# EAGLE design DC-DC (EAGLE 9.6.2)
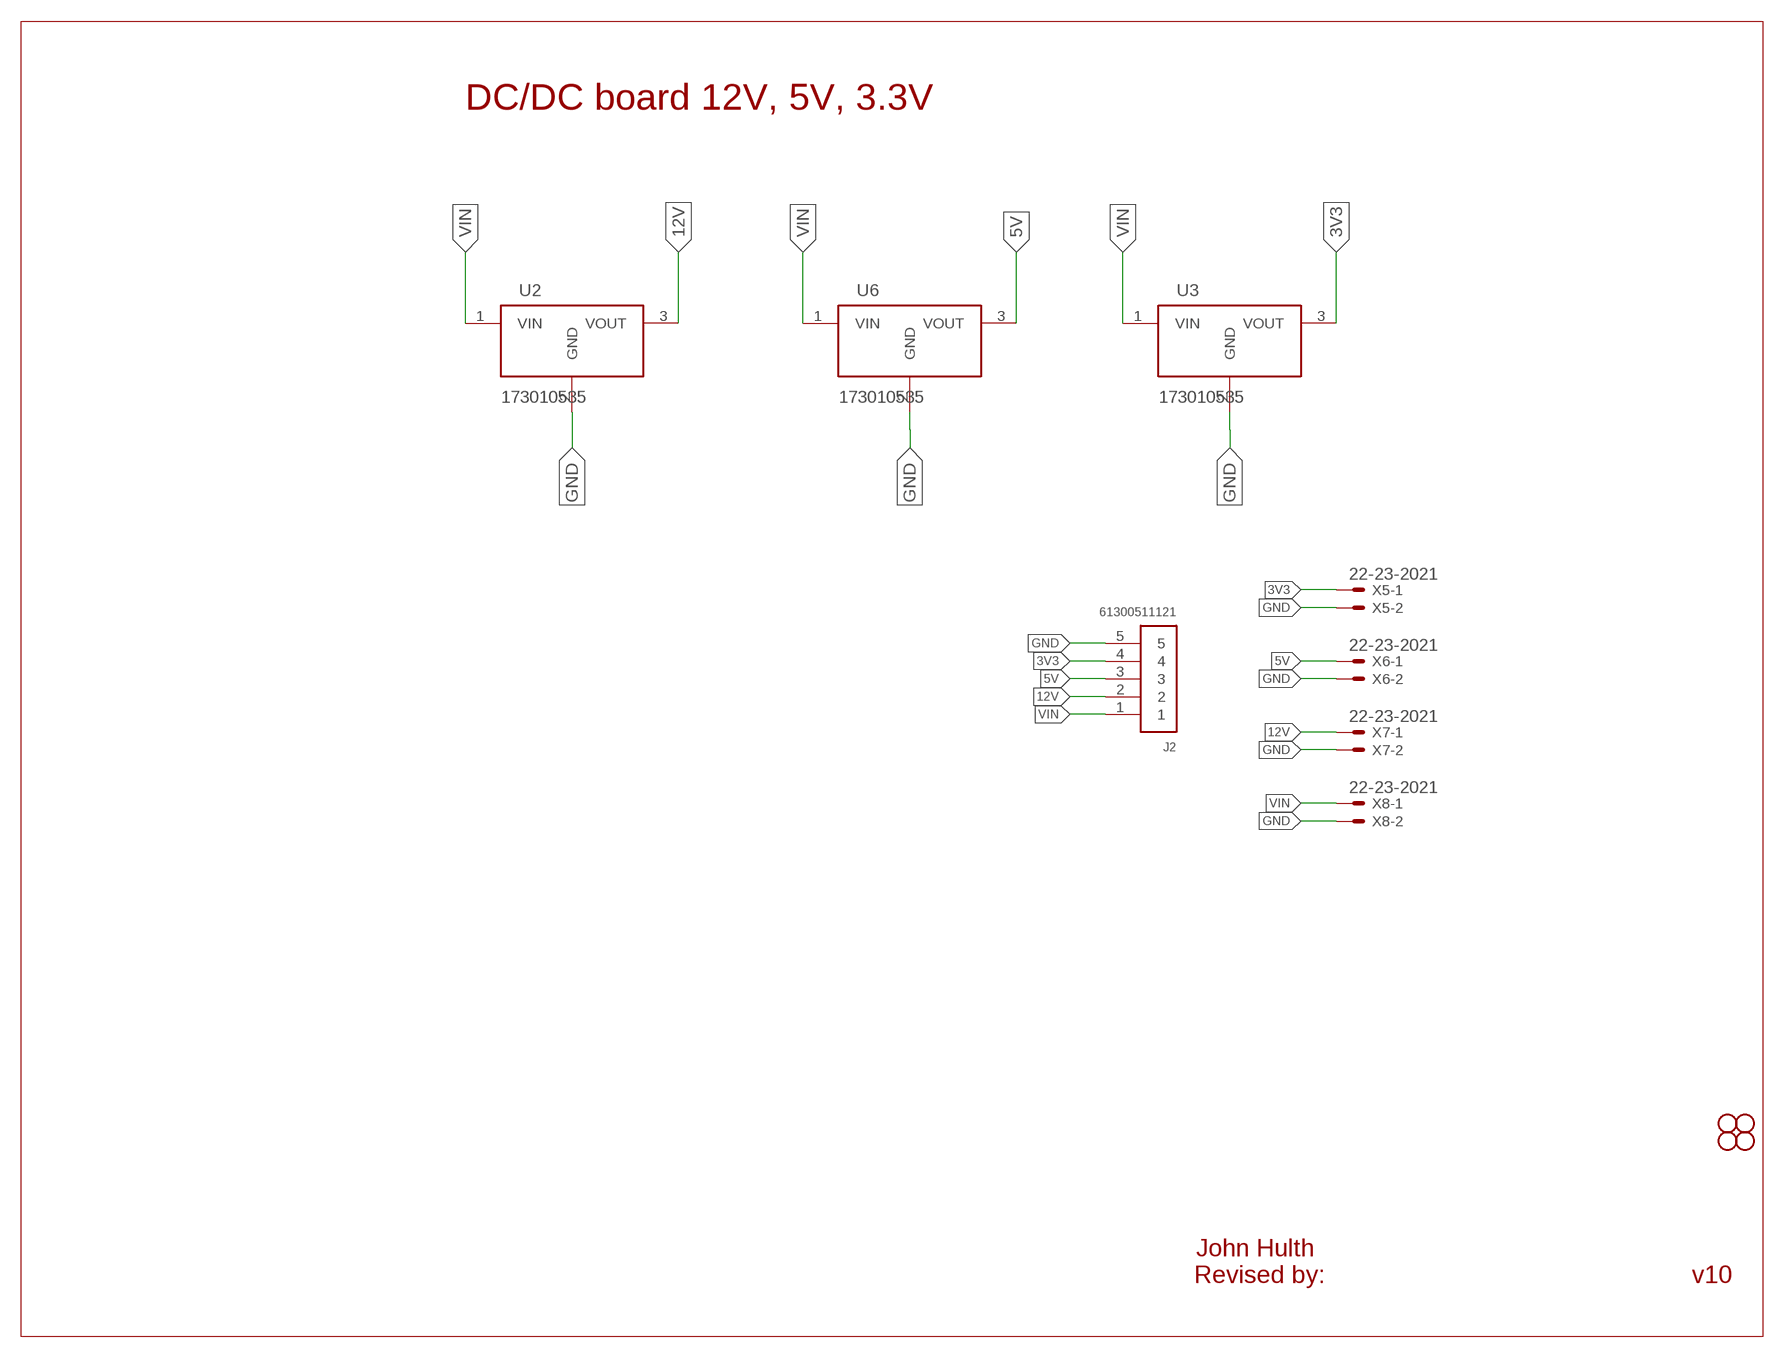
[diagram p0: schematic, sheet 1]

## Parts
J2  61300511121  [61300511121]
JP1  STAND-OFF  [STAND-OFF]
JP4  STAND-OFF  [STAND-OFF]
JP5  STAND-OFF  [STAND-OFF]
JP6  STAND-OFF  [STAND-OFF]
U2  173010535  [173010535]
U3  173010535  [173010535]
U6  173010535  [173010535]
X5  22-23-2021  [22-23-2021]
X6  22-23-2021  [22-23-2021]
X7  22-23-2021  [22-23-2021]
X8  22-23-2021  [22-23-2021]

## Nets
3V3: J2.4 U3.3(VOUT) X5.1
5V: J2.3 U6.3(VOUT) X6.1
12V: J2.2 U2.3(VOUT) X7.1
GND: J2.5 U2.2(GND) U3.2(GND) U6.2(GND) X5.2 X6.2 X7.2 X8.2
VIN: J2.1 U2.1(VIN) U3.1(VIN) U6.1(VIN) X8.1

## Notes on the sheet
- DC/DC board 12V, 5V, 3.3V
- John Hulth
- Revised by: | v10

## Library data of the parts
J2 = Headers:61300511121: CONN HEADER VERT 5POS 2.54MM Manufacturer's datasheet <https://katalog.we-online.de/em/datasheet/6130xx11121.pdf>; CREATED_BY: PCBLayout.com; DIGI_KEY_PART_NUMBER: 732-5318-ND; MANUFACTURER: Wurth Electronics Inc.; MPN: 61300511121
JP1 JP4-JP6 = SparkFun:STAND-OFF: Stand Off This is the mechanical footprint for a #4 phillips button head screw. Use the keepout ring to avoid running the screw head into surrounding components. SKU : PRT-00447
U2 U3 U6 = DC-DC Converter:173010535: FDSM FIXED STEP DOWN REGULATOR M Manufacturer's datasheet <https://www.we-online.com/catalog/datasheet/173010335.pdf>; CREATED_BY: PCBLayout.com; DIGIKEY_PARTNO: 732-173010535-ND; MANUFACTURER: Würth Elektronik; MPN: 173010535
X5-X8 = con-molex:22-23-2021: .100" (2.54mm) Center Header - 2 Pin; MF: MOLEX; MPN: 22-23-2021; OC_FARNELL: 1462926; OC_NEWARK: 25C3832

## Board
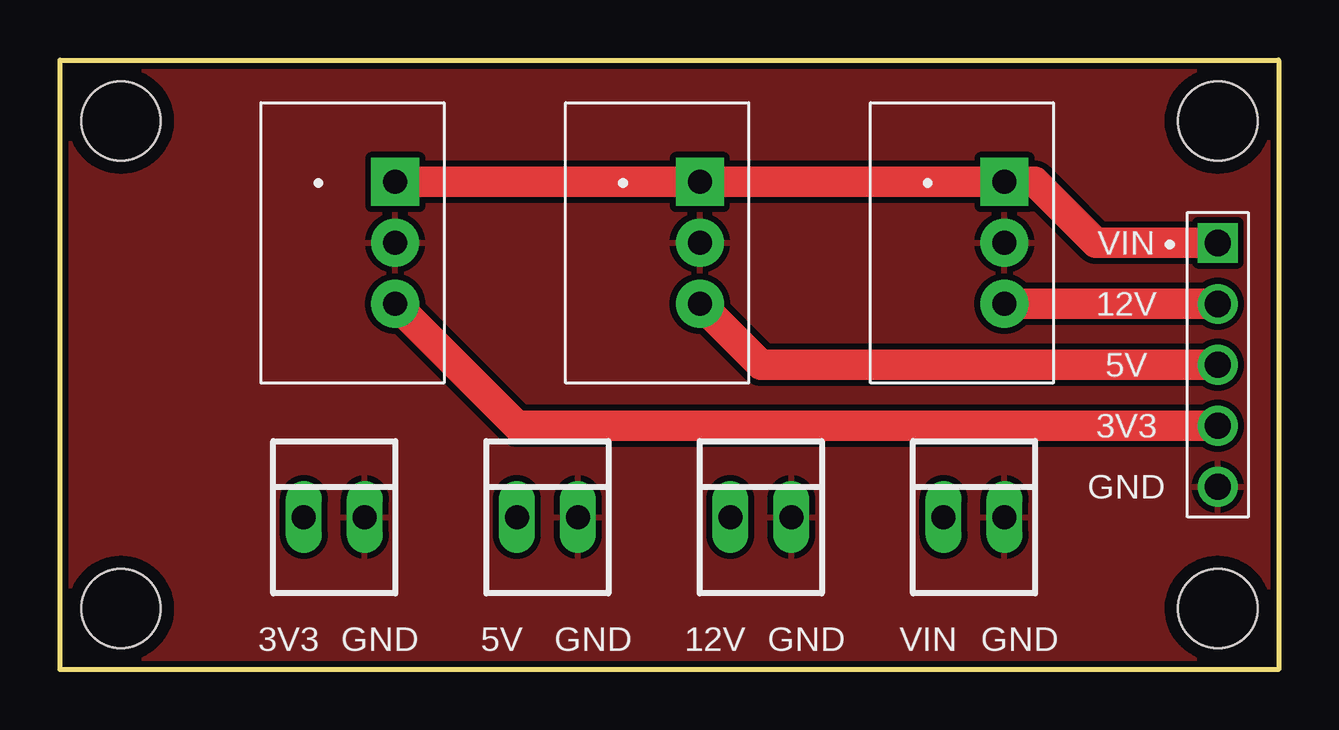
[diagram p1: board, top side]
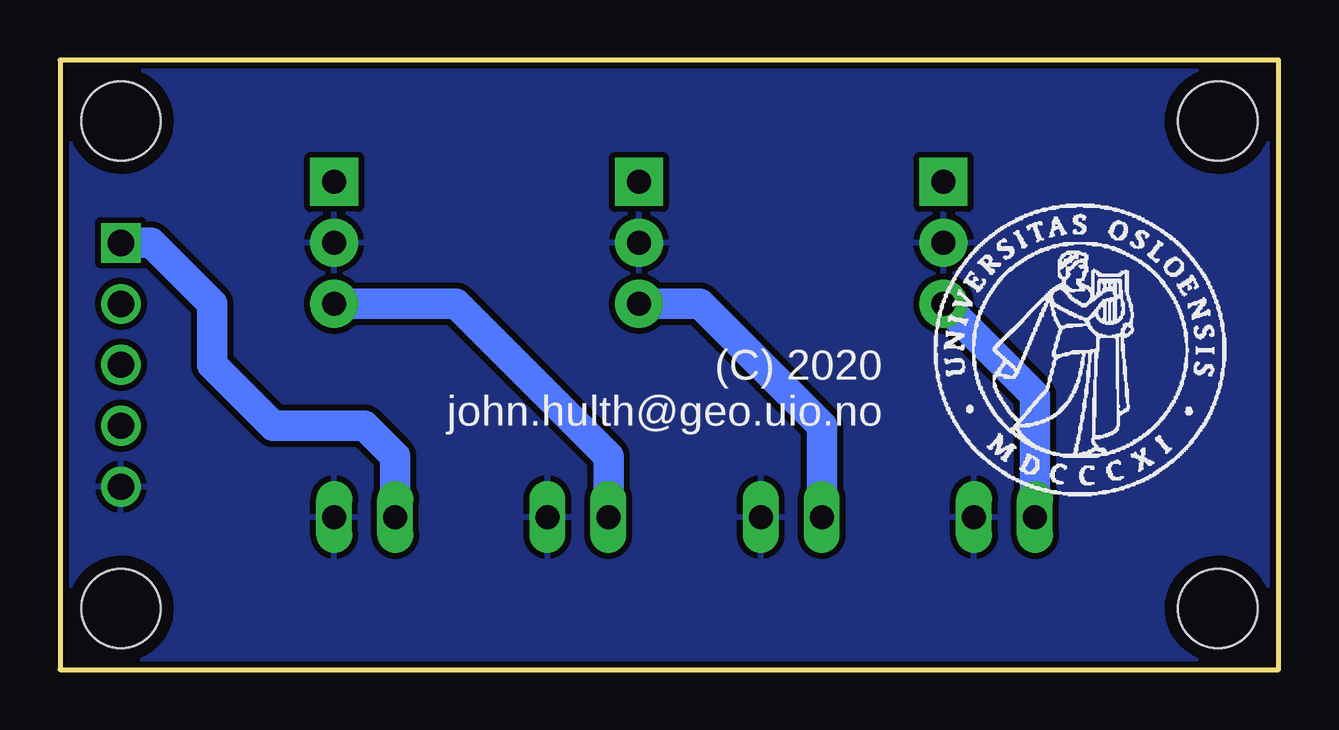
[diagram p2: board, bottom side, seen from below]

Size 50.8 x 25.4 mm. Coordinates in mm from the lower left corner, seen from the top.
Outline: 0,0 0,25.4 50.8,25.4 50.8,0 0,0
Copper layers (1*16): Top 0.035mm / dielectric 1.5mm / Bottom 0.035mm
Design rules "SparkFun-2-layer-TIGHT": minimum track width 7mil, minimum drill 15mil, track to track 7mil, track to pad 7mil, pad to pad 7mil, via to via 7mil, smd to smd 7mil, copper to edge 7mil, drill to drill 7mil, minimum pad ring 7mil, minimum via ring 7mil, stop-mask expansion 4mil, vias tented up to drill 25mil, thermal gap 10mil

### Footprints (pad centres in the part's own frame; a part is rotated, then mirrored left to right if it is on the bottom)
61300511121 = drill 1.1 square: 1 -5.08,0 | drill 1.1: 2 -2.54,0; 3 0,0; 4 2.54,0; 5 5.08,0
STAND-OFF = hole 3.302: 0,0
173010535 = drill 1 pad 2 square: 1 -2.54,0 | drill 1 pad 2: 2 0,0; 3 2.54,0
22-23-2021 = drill 1 long: 1 -1.27,0; 2 1.27,0

### Placement (x,y rotation side)
J2  48.26,12.7 270 top
JP1  48.26,22.86 0 top
JP4  2.54,22.86 0 top
JP5  2.54,2.54 0 top
JP6  48.26,2.54 0 top
U2  39.37,17.78 270 top
U3  13.97,17.78 270 top
U6  26.67,17.78 270 top
U$1  [UIO-LOGO-BL]  14.61,6.99 0 bottom
X5  11.43,6.35 0 top
X6  20.32,6.35 0 top
X7  29.21,6.35 0 top
X8  38.1,6.35 0 top

### Tracks (layer width: path | path; a pad name or v marks a point on that pad's centre or on a via)
3V3
  Top 1.27: J2.4 19.05,10.16 U3.3
  Bottom 1.27: X5.1 10.16,11.43 U3.3
5V
  Top 1.27: J2.3 29.21,12.7 U6.3
  Bottom 1.27: X6.1 19.05,10.16 24.13,15.24 U6.3
12V
  Top 1.27: J2.2 U2.3
  Bottom 1.27: X7.1 27.94,8.89 34.29,15.24 U2.3
GND
  pour Top (isolate 0.254): 50.8,0 50.8,25.4 0,25.4 0,0
  pour Bottom (isolate 0.254): 50.8,0 50.8,25.4 0,25.4 0,0
VIN
  Top 1.27: J2.1 43.18,17.78 40.64,20.32 U2.1 U6.1 U3.1
  Bottom 1.27: 36.83,7.62 X8.1 36.83,8.89 38.1,10.16 41.91,10.16 44.45,12.7 44.45,15.24 46.99,17.78 J2.1

### Text on the board
tPlace: VIN | 12V | 5V | 3V3 | GND | 3V3 | GND | 5V | GND | 12V | GND | VIN | GND
bPlace: (C) 2020 / john.hulth@geo.uio.no